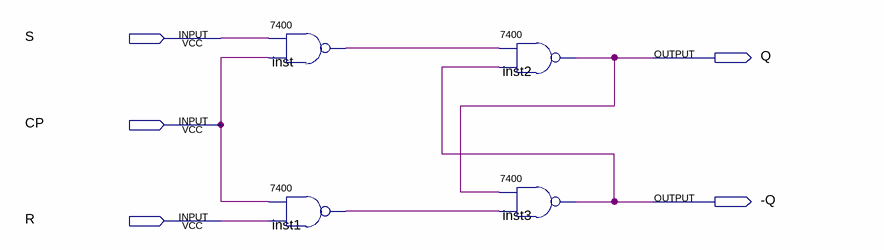
[diagram p0: schematic sheet]
// Quartus schematic Clock_RS.bdf as structural Verilog: 4 symbols, 5 pins
module Clock_RS (
  input  S,
  input  CP,
  input  R,
  output Q,
  output \-Q 
);

  wire inst1_1, inst_1;

  \7400  inst (.\3 (CP), .\2 (S), .\1 (inst_1));
  \7400  inst1 (.\3 (R), .\2 (CP), .\1 (inst1_1));
  \7400  inst2 (.\3 (\-Q ), .\2 (inst_1), .\1 (Q));
  \7400  inst3 (.\3 (inst1_1), .\2 (Q), .\1 (\-Q ));
endmodule
